# Altium schematic sheet Schematic_Robot.SchDoc
size A4
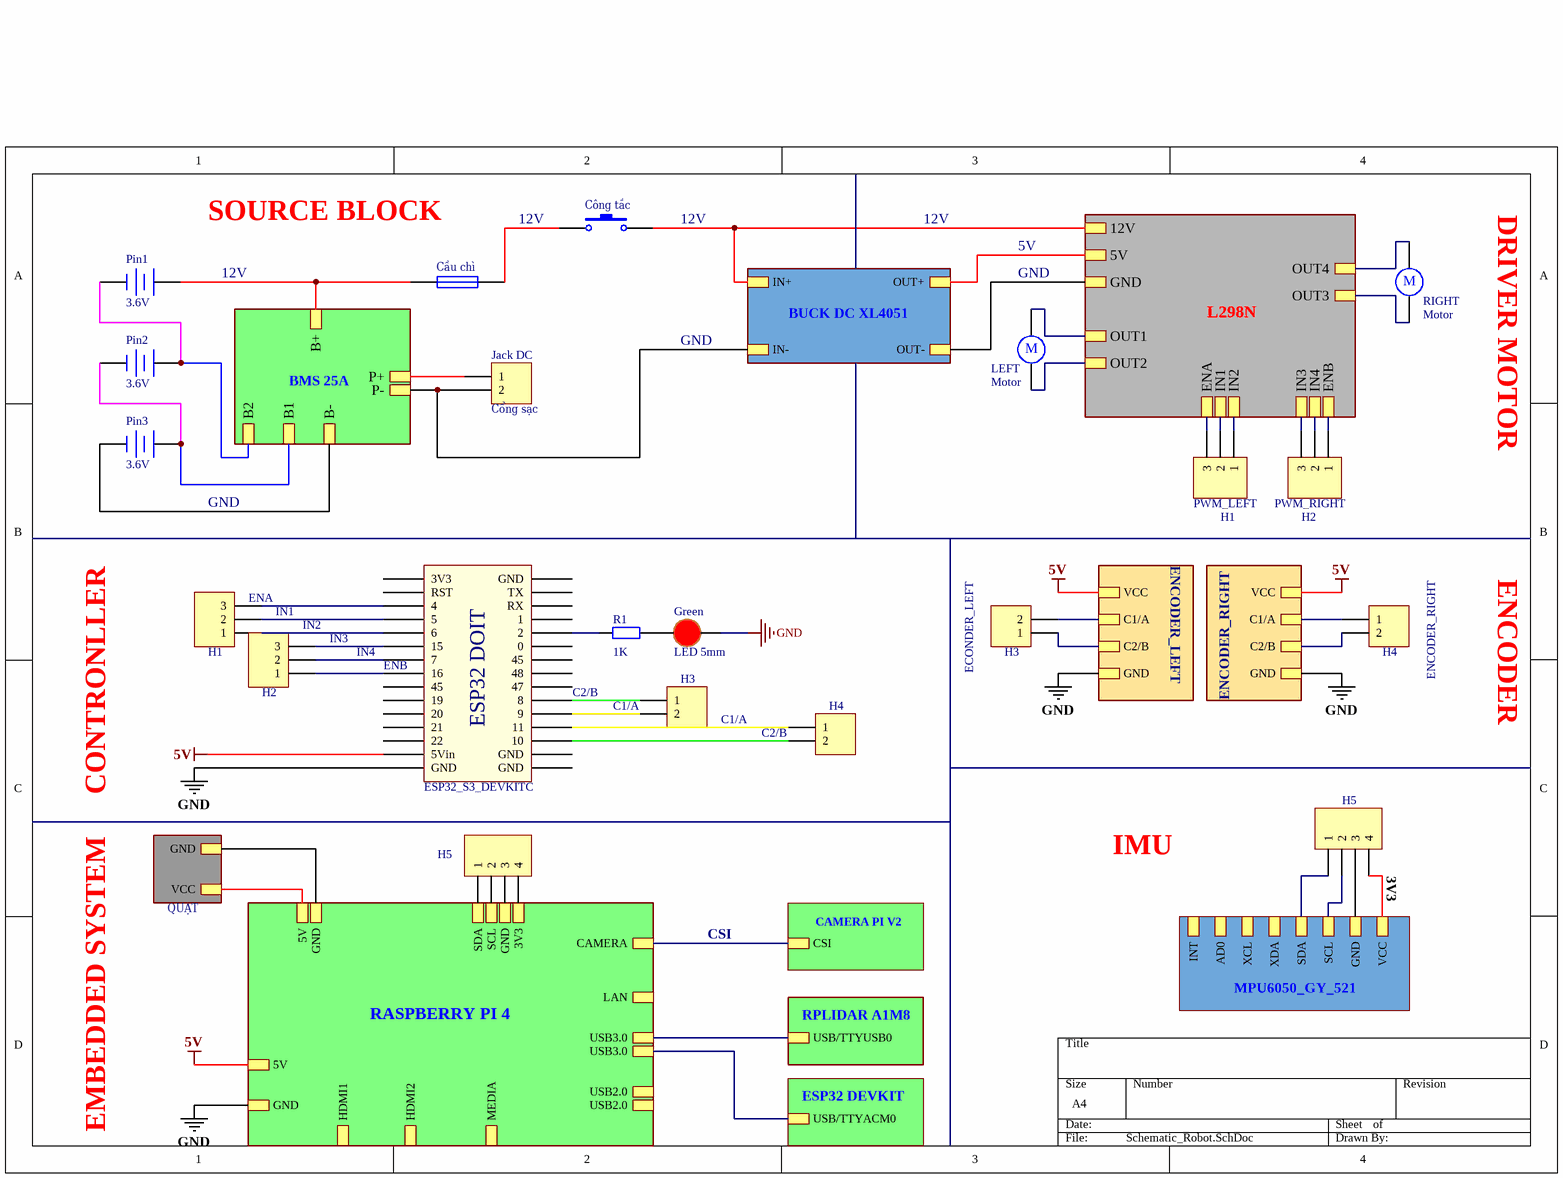
[diagram p0: Schematic_Robot.SchDoc]

## Parts
(Parts that share a designator on the sheet are numbered #1, #2 ... from top to bottom, then left to right.)
CONTROLLER  ESP32_S3_DEVKITC  [ESP32 WROOM 32 KIT]
Công_tắc  SW-PB  [SPST-2]  (value not drawn)
Cầu_chì  Fuse 1  [PIN-W2/E2.8]  (value not drawn)
ECONDER_LEFT#1  H3  [HDR1X2]
ECONDER_LEFT#2  H3  [HDR1X2]
ENCODER_RIGHT#1  H4  [HDR1X2]
ENCODER_RIGHT#2  H4  [HDR1X2]
Green  LED 5mm  [LED-5MM-RED]
Jack_DC  Cổng sạc  [HDR1X2]
LEFT  Motor  [RB5-10.5]
P?#1  H5  [HDR1X4]
P?#2  H5  [HDR1X4]
Pin1  3.6V  [BAT-2]
Pin2  3.6V  [BAT-2]
Pin3  3.6V  [BAT-2]
PWM_LEFT#1  H1  [HDR1X3]
PWM_LEFT#2  H1  [HDR1X3]
PWM_RIGHT#1  H2  [HDR1X3]
PWM_RIGHT#2  H2  [HDR1X3]
R1  1K  [tro vach 1/4w]
RIGHT  Motor  [RB5-10.5]

## Sub-sheets
BMS 25A = File Name: B+, P-, B2, B1, B-, P+
BUCK DC XL4051 = File Name: IN+, IN-, OUT+, OUT-
CAMERA PI V2 = File Name: CSI
ENCODER_LEFT = File Name: VCC, C1/A, C2/B, GND
ENCODER_RIGHT = File Name: GND, C2/B, C1/A, VCC
ESP32 DEVKIT = File Name: USB/TTYACM0
L298N = File Name: 12V, 5V, GND, OUT1, OUT2, OUT3, OUT4, ENA, IN1, IN2, IN3, IN4, ENB
MPU6050_GY_521 = File Name: GND, SCL, SDA, XDA, XCL, INT, AD0, VCC
QUẠT = File Name: VCC, GND
RASPBERRY PI 4 = File Name: USB2.0, 5V, SDA, SCL, GND, 3V3, CAMERA, LAN, USB3.0, USB3.0, MEDIA, HDMI2, HDMI1, USB2.0, 5V, GND, GND
RPLIDAR A1M8 = File Name: USB/TTYUSB0

## Nets
5V: CONTROLLER.14(5Vin) ; sheet ENCODER_LEFT/VCC, sheet ENCODER_RIGHT/VCC, sheet RASPBERRY PI 4/5V
GND: CONTROLLER.15(GND) Green.2(K) ; sheet ENCODER_LEFT/GND, sheet ENCODER_RIGHT/GND, sheet RASPBERRY PI 4/GND
NetCONTROLLER_4: CONTROLLER.4(5) PWM_LEFT#2.2
NetCONTROLLER_5: CONTROLLER.5(6) PWM_LEFT#2.1
NetCONTROLLER_6: CONTROLLER.6(15) PWM_RIGHT#2.3
NetCONTROLLER_7: CONTROLLER.7 PWM_RIGHT#2.2
NetCONTROLLER_8: CONTROLLER.8(16) PWM_RIGHT#2.1
NetCONTROLLER_18: CONTROLLER.18(10) ENCODER_RIGHT#2.2
NetCONTROLLER_19: CONTROLLER.19(11) ENCODER_RIGHT#2.1
NetCONTROLLER_20: CONTROLLER.20(9) ECONDER_LEFT#2.2
NetCONTROLLER_21: CONTROLLER.21(8) ECONDER_LEFT#2.1
NetCONTROLLER_26: CONTROLLER.26(2) R1.1
NetCONTROLLER_ENA: CONTROLLER.ENA(4) PWM_LEFT#2.3
NetCông_tắc_1: Công_tắc.1 Cầu_chì.2
NetCông_tắc_2: Công_tắc.2 ; sheet BUCK DC XL4051/IN+, sheet L298N/12V
NetCầu_chì_1: Cầu_chì.1 Pin1.1(+) ; sheet BMS 25A/B+
NetECONDER_LEFT#1_1: ECONDER_LEFT#1.1 ; sheet ENCODER_LEFT/C2/B
NetECONDER_LEFT#1_2: ECONDER_LEFT#1.2 ; sheet ENCODER_LEFT/C1/A
NetENCODER_RIGHT#1_1: ENCODER_RIGHT#1.1 ; sheet ENCODER_RIGHT/C1/A
NetENCODER_RIGHT#1_2: ENCODER_RIGHT#1.2 ; sheet ENCODER_RIGHT/C2/B
NetGreen_1: Green.1(A) R1.2
NetJack_DC_1: Jack_DC.1 ; sheet BMS 25A/P+
NetJack_DC_2: Jack_DC.2 ; sheet BUCK DC XL4051/IN-, sheet BMS 25A/P-
NetLEFT_1: LEFT.1 ; sheet L298N/OUT1
NetLEFT_2: LEFT.2 ; sheet L298N/OUT2
NetP?#1_1: P?#1.1 ; sheet MPU6050_GY_521/SDA
NetP?#1_2: P?#1.2 ; sheet MPU6050_GY_521/SCL
NetP?#1_3: P?#1.3 ; sheet MPU6050_GY_521/GND
NetP?#1_4: P?#1.4 ; sheet MPU6050_GY_521/VCC
NetP?#2_1: P?#2.1 ; sheet RASPBERRY PI 4/SDA
NetP?#2_2: P?#2.2 ; sheet RASPBERRY PI 4/SCL
NetP?#2_3: P?#2.3 ; sheet RASPBERRY PI 4/GND
NetP?#2_4: P?#2.4 ; sheet RASPBERRY PI 4/3V3
NetPin1_2: Pin1.2(-) Pin2.1(+) ; sheet BMS 25A/B2
NetPin2_2: Pin2.2(-) Pin3.1(+) ; sheet BMS 25A/B1
NetPin3_2: Pin3.2(-) ; sheet BMS 25A/B-
NetPWM_LEFT#1_1: PWM_LEFT#1.1 ; sheet L298N/IN2
NetPWM_LEFT#1_2: PWM_LEFT#1.2 ; sheet L298N/IN1
NetPWM_LEFT#1_3: PWM_LEFT#1.3 ; sheet L298N/ENA
NetPWM_RIGHT#1_1: PWM_RIGHT#1.1 ; sheet L298N/ENB
NetPWM_RIGHT#1_2: PWM_RIGHT#1.2 ; sheet L298N/IN4
NetPWM_RIGHT#1_3: PWM_RIGHT#1.3 ; sheet L298N/IN3
NetRIGHT_1: RIGHT.1 ; sheet L298N/OUT4
NetRIGHT_2: RIGHT.2 ; sheet L298N/OUT3
(unnamed): sheet BUCK DC XL4051/OUT+, sheet L298N/5V
(unnamed): sheet BUCK DC XL4051/OUT-, sheet L298N/GND
(unnamed): sheet RASPBERRY PI 4/5V, sheet QUẠT/VCC
(unnamed): sheet RASPBERRY PI 4/CAMERA, sheet CAMERA PI V2/CSI
(unnamed): sheet RASPBERRY PI 4/USB3.0, sheet RPLIDAR A1M8/USB/TTYUSB0
(unnamed): sheet RASPBERRY PI 4/USB3.0, sheet ESP32 DEVKIT/USB/TTYACM0
(unnamed): sheet RASPBERRY PI 4/GND, sheet QUẠT/GND

Not connected (* = marked no-connect by the designer): CONTROLLER 1(3V3) 2(RST) 9(45) 10(19) 11(20) 12(21) 13(22) 16(GND) 17(GND) 22(47) 23(48) 24(45) 25(0) 27(1) 28(RX) 29(TX) 30(GND)

## Notes on the sheet
- SOURCE BLOCK
- 12V
- 5V
- DRIVER MOTOR
- GND
- ENCODER
- (near PWM_LEFT#2) ENA
- IN1
- (near PWM_RIGHT#2) IN2
- (near PWM_RIGHT#2) IN3
- IN4
- (near CONTROLLER) ENB
- C2/B
- (near ECONDER_LEFT#2) C1/A
- C1/A
- CONTRONLLER
- (near ENCODER_RIGHT#2) C2/B
- IMU
- (near P?#1) 3V3
- CSI
- EMBEDDED SYSTEM
- (in symbol ESP32 WROOM 32 KIT) ESP32 DOIT
- (in symbol Motor) M

## Library data of the parts
CONTROLLER = ESP32 WROOM 32 KIT
Công_tắc = SW-PB: Switch; Published: 24-Mar-1999; LatestRevisionDate: 17-Jul-2002; LatestRevisionNote: Re-released for DXP Platform.; PackageReference: SPST-2; Publisher: Altium Limited; PackageDescription: Switch; 2 Leads
Cầu_chì = Fuse 1: Fuse; Published: 8-Jun-2000; LatestRevisionDate: 17-Jul-2002; LatestRevisionNote: Re-released for DXP Platform.; PackageReference: PIN-W2/E2.8; Publisher: Altium Limited; PackageDescription: Thru-Hole; 2 Leads
ECONDER_LEFT#1 ECONDER_LEFT#2 ENCODER_RIGHT#1 ENCODER_RIGHT#2 Jack_DC = Header 2: Header, 2-Pin; LatestRevisionDate: 17-Jul-2002; LatestRevisionNote: Re-released for DXP Platform.; Publisher: Altium Limited
Green = LED 5mm Do: Don_Vi: Con; Chung_Loai: Cắm; Ma_Hang: MH008967; Ten_Linh_Kien: Led 5MM Phủ Đỏ (1000c); Ghi_Chu: *; Kieu_Chan: *
LEFT RIGHT = Motor: Motor, General Kind; Published: 24-Mar-1999; LatestRevisionDate: 17-Jul-2002; LatestRevisionNote: Re-released for DXP Platform.; PackageReference: RB5-10.5; Publisher: Altium Limited; PackageDescription: Capacitor (Radial); 2 Leads
P?#1 P?#2 = Header 4: Header, 4-Pin; LatestRevisionDate: 17-Jul-2002; LatestRevisionNote: Re-released for DXP Platform.; Publisher: Altium Limited
Pin1-Pin3 = Battery: Multicell Battery; Published: 24-Mar-1999; LatestRevisionDate: 17-Jul-2002; LatestRevisionNote: Re-released for DXP Platform.; PackageReference: BAT-2; Publisher: Altium Limited; PackageDescription: Battery; 2 Leads
PWM_LEFT#1 PWM_LEFT#2 PWM_RIGHT#1 PWM_RIGHT#2 = Header 3: Header, 3-Pin; LatestRevisionDate: 17-Jul-2002; LatestRevisionNote: Re-released for DXP Platform.; Publisher: Altium Limited
R1 = Tro Vach 1/4W 5% 1k: Chung_Loai: Cắm; Don_Vi: Con; So_Chan: 2; Ten_Linh_Kien: Trở Vạch 1/4w 5% 1k; Ma_Hang: MH007390; Kieu_Chan: *